# EAGLE design alimentadorV3 (EAGLE 6.6.0)
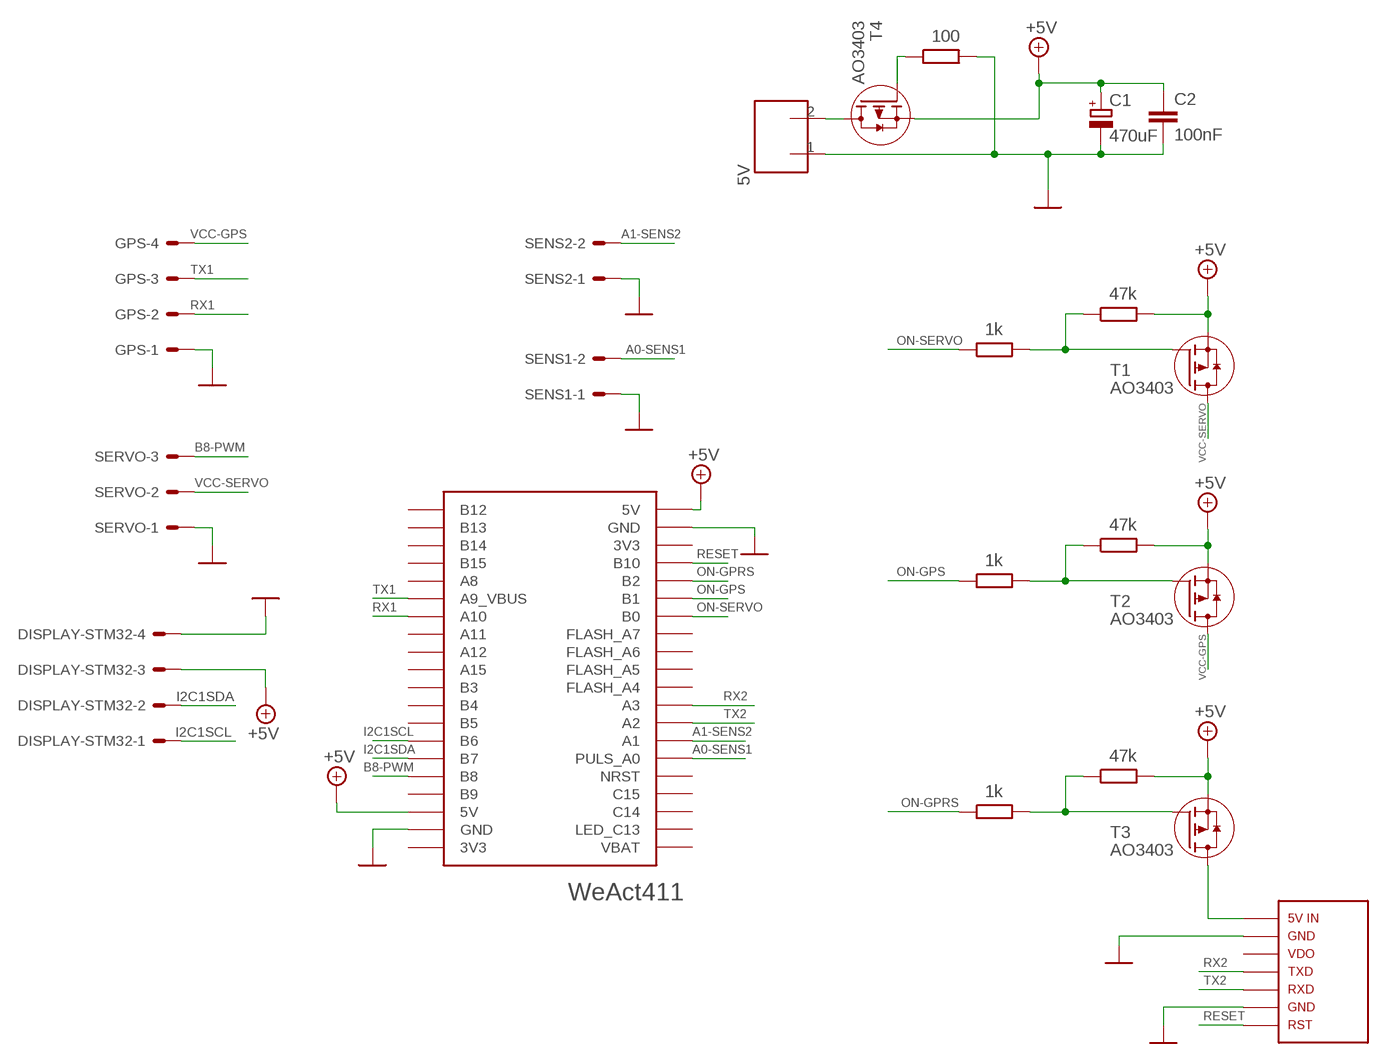
[diagram p0: schematic, sheet 1]

## Parts
5V  CONECTOR_2P-3.81  [CON2P-3.81]
C1  470uF  CPOL-EUE5-10.5  [E5-10,5]
C2  100nF  C-EUC1206  [C1206]
DISPLAY-STM32  22-05-7048-04  [7395-04]
GPS  22-27-2041-04  [6410-04]
R1  47k  R-EU_R1206  [R1206]
R2  47k  R-EU_R1206  [R1206]
R3  1k  R-EU_R1206  [R1206]
R4  1k  R-EU_R1206  [R1206]
R5  47k  R-EU_R1206  [R1206]
R6  1k  R-EU_R1206  [R1206]
R7  100  R-EU_R1206  [R1206]
SENS1  22-27-2021-02  [6410-02]
SENS2  22-27-2021-02  [6410-02]
SERVO  22-27-2031-03  [6410-03]
T1  AO3403  [SOT23]
T2  AO3403  [SOT23]
T3  AO3403  [SOT23]
T4  AO3403  [SOT23]
U$1  SIM800L  [SIM800L]
U$2  WEACT411  [WEACT411]

## Nets
5VIN: T3.3(D) U$1.5VIN
+5V: C1.+ C2.1 DISPLAY-STM32.3 R1.2 R2.2 R5.2 T1.2(S) T2.2(S) T3.2(S) T4.2(S) U$2.5V@1(5V) U$2.5V@2(5V)
A0-SENS1: SENS1.2 U$2.A0(PULS_A0)
A1-SENS2: SENS2.2 U$2.A1
B8-PWM: SERVO.3 U$2.B8
GND [pwr]: 5V.1 C1.- C2.2 DISPLAY-STM32.4 GPS.1 R7.2 SENS1.1 SENS2.1 SERVO.1 U$1.GND@0(GND) U$1.GND@1(GND) U$2.GND@1(GND) U$2.GND@2(GND)
I2C1SCL: DISPLAY-STM32.1 U$2.B6
I2C1SDA: DISPLAY-STM32.2 U$2.B7
N$1: 5V.2 T4.3(D)
N$2: R2.1 R3.2 T1.1(G)
N$3: R7.1 T4.1(G)
N$5: R1.1 R4.2 T2.1(G)
N$8: R5.1 R6.2 T3.1(G)
ON-GPRS: R6.1 U$2.B2
ON-GPS: R4.1 U$2.B1
ON-SERVO: R3.1 U$2.B0
RESET: U$1.RST U$2.B10
RX1: GPS.2 U$2.A10
RX2: U$1.TXD U$2.A3
TX1: GPS.3 U$2.A9(A9_VBUS)
TX2: U$1.RXD U$2.A2
VCC-GPS: GPS.4 T2.3(D)
VCC-SERVO: SERVO.2 T1.3(D)
Unconnected: U$1.VDO U$2.3V3@1(3V3) U$2.3V3@2(3V3) U$2.A4(FLASH_A4) U$2.A5(FLASH_A5) U$2.A6(FLASH_A6) U$2.A7(FLASH_A7) U$2.A8 U$2.A11 U$2.A12 U$2.A15 U$2.B3 U$2.B4 U$2.B5 U$2.B9 U$2.B12 U$2.B13 U$2.B14 U$2.B15 U$2.C13(LED_C13) U$2.C14 U$2.C15 U$2.NRST U$2.VBAT

## Library data of the parts
5V = jcf:CONECTOR_2P-3.81
C1 = rcl:CPOL-EU: POLARIZED CAPACITOR, European symbol
C2 = rcl:C-EU: CAPACITOR, European symbol
DISPLAY-STM32 GPS = con-molex:22-?-04: CONNECTOR wire to board 2.54 mm (.1 inch) pitch header; OC_FARNELL: unknown; OC_NEWARK: unknown
R1-R7 = rcl:R-EU_: RESISTOR, European symbol
SENS1 SENS2 = con-molex:22-?-02: CONNECTOR wire to board 2.54 mm (.1 inch) pitch header; OC_FARNELL: unknown; OC_NEWARK: unknown
SERVO = con-molex:22-?-03: CONNECTOR wire to board 2.54 mm (.1 inch) pitch header; OC_FARNELL: unknown; OC_NEWARK: unknown
T1-T4 = jcf:AO3403: AO3403 P-channel MOSFET 2.6A 30V
U$1 = jcf:SIM800L: SIM800L https://www.amazon.es/dp/B01FK3OPQ6/ref=pe_386191_37038281_TE_3p_dp_1
U$2 = jcf:WEACT411: WeAct STM32F411

## Net classes
0 default: width 0.241 mm, drill 0.584 mm, clearance 0.241 mm
1 pwr: width 0.25 mm

## Board
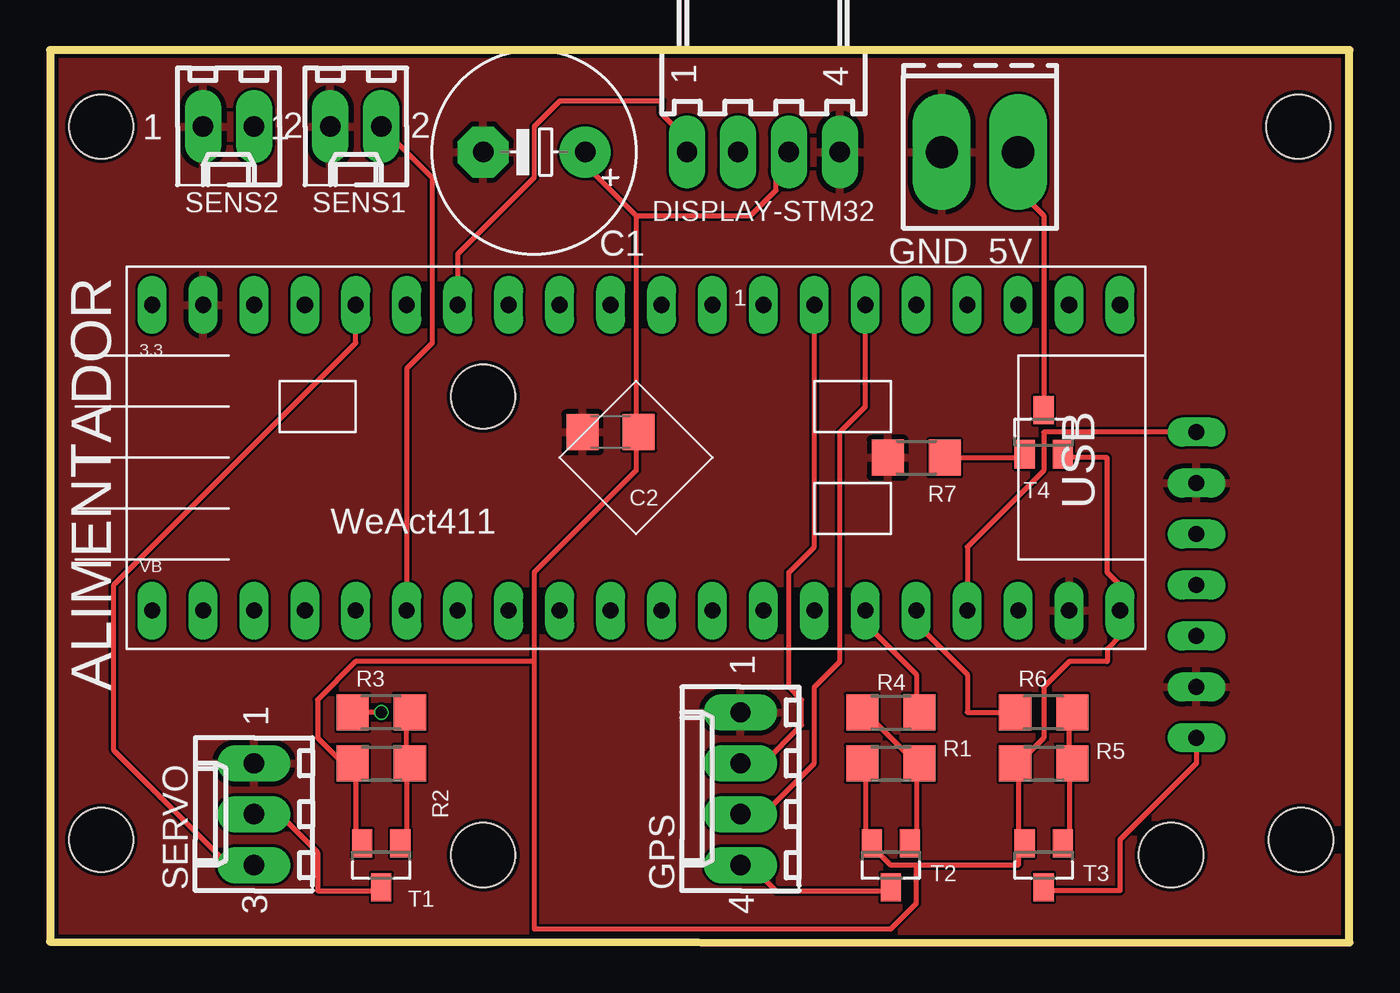
[diagram p1: board, top side]
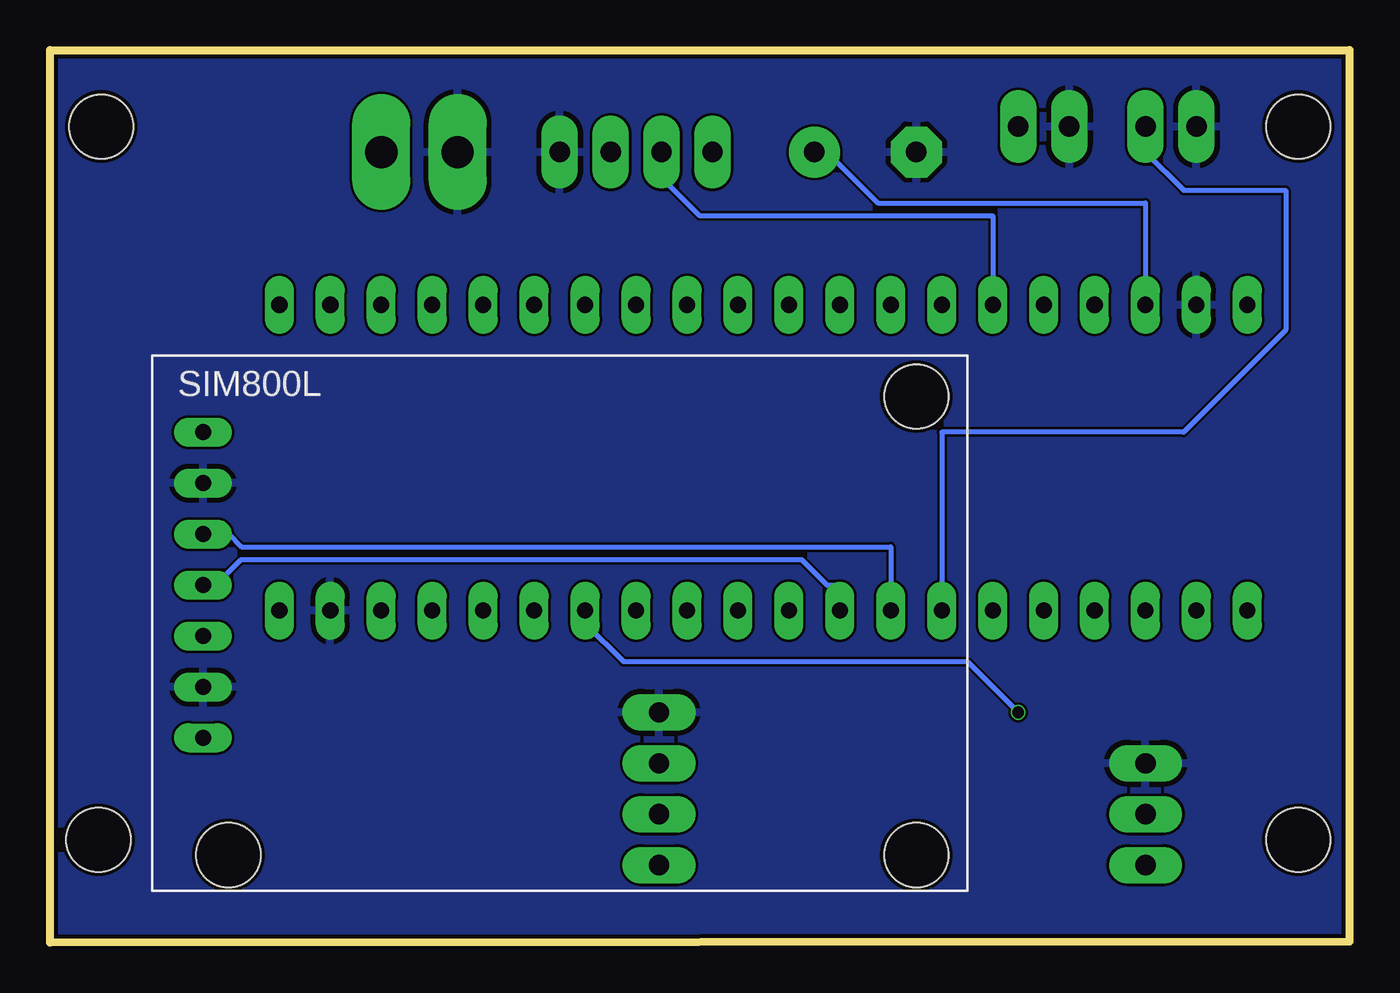
[diagram p2: board, bottom side, seen from below]

Size 64.77 x 44.5 mm. Coordinates in mm from the lower left corner, seen from the top.
Outline: 0,44.5 0,0.05 64.77,0 64.77,44.5 0,44.5
Copper layers (1*16): Top 0.035mm / dielectric 1.6mm / Bottom 0.035mm
Design rules "jlcpcb-2layers": minimum track width 5mil, minimum drill 0.3mm, track to track 5mil, track to pad 5mil, pad to pad 5mil, via to via 5mil, smd to smd 5mil, copper to edge 0.2mm, drill to drill 6mil, minimum pad ring 10mil, minimum via ring 3mil, stop-mask expansion 4mil, vias tented up to drill 0mil, thermal gap 10mil
Holes 3.2 mm at 62.36,5.13 2.54,5.13 62.23,40.69 2.54,40.69

### Footprints (pad centres in the part's own frame; a part is rotated, then mirrored left to right if it is on the bottom)
CON2P-3.81 = drill 1.6 long: 1 0,0; 2 3.81,0
E5-10,5 = drill 1.016 pad 2.54: + -2.54,0 | drill 1.016 pad 2.54 octagon: - 2.54,0
C1206 = smd 1.6 x 1.8: 1 -1.4,0; 2 1.4,0
7395-04 = drill 1.016 long: 1 3.81,0; 2 1.27,0; 3 -1.27,0; 4 -3.81,0
6410-04 = drill 1.016 long: 1 3.81,0; 2 1.27,0; 3 -1.27,0; 4 -3.81,0
R1206 = smd 1.6 x 1.803: 1 -1.422,0; 2 1.422,0
6410-02 = drill 1.016 long: 1 1.27,0; 2 -1.27,0
6410-03 = drill 1.016 long: 1 2.54,0; 2 0,0; 3 -2.54,0
SOT23 = smd 1 x 1.4: 1 -0.95,-1.1; 2 0.95,-1.1; 3 0,1.1
SIM800L = drill 0.8 long: 5VIN -2.54,19.05; GND@0 -2.54,6.35; GND@1 -2.54,16.51; RST -2.54,3.81; RXD -2.54,8.89; TXD -2.54,11.43; VDO -2.54,13.97 | hole 3.2: -3.81,24.892; -38.1,24.892; -38.1,2.032
WEACT411 = drill 0.8 long: 3V3@1 43.18,0; 3V3@2 0,15.24; 5V@1 48.26,0; 5V@2 5.08,15.24; A0 12.7,0; A1 15.24,0; A2 17.78,0; A3 20.32,0; A4 22.86,0; A5 25.4,0; A6 27.94,0; A7 30.48,0; A8 38.1,15.24; A9 35.56,15.24; A10 33.02,15.24; A11 30.48,15.24; A12 27.94,15.24; A15 25.4,15.24; B0 33.02,0; B1 35.56,0; B2 38.1,0; B3 22.86,15.24; B4 20.32,15.24; B5 17.78,15.24; B6 15.24,15.24; B7 12.7,15.24; B8 10.16,15.24; B9 7.62,15.24; B10 40.64,0; B12 48.26,15.24; B13 45.72,15.24; B14 43.18,15.24; B15 40.64,15.24; C13 2.54,0; C14 5.08,0; C15 7.62,0; GND@1 45.72,0; GND@2 2.54,15.24; NRST 10.16,0; VBAT 0,0

### Placement (x,y rotation side)
5V  44.45,39.42 0 top
C1  24.13,39.42 180 top
C2  27.94,25.45 180 top
DISPLAY-STM32  35.56,39.42 180 top
GPS  34.42,7.67 90 top
R1  41.91,8.94 180 top
R2  16.51,8.94 180 top
R3  16.51,11.48 0 top
R4  41.91,11.48 180 top
R5  49.53,8.94 180 top
R6  49.53,11.48 0 top
R7  43.18,24.18 180 top
SENS1  15.24,40.69 180 top
SENS2  8.89,40.69 180 top
SERVO  10.16,6.4 90 top
T1  16.51,3.86 180 top
T2  41.91,3.86 180 top
T3  49.53,3.86 180 top
T4  49.53,25.45 0 top
U$1  59.69,29.26 180 bottom
U$2  5.08,16.56 0 top

### Tracks (layer width: path | path; a pad name or v marks a point on that pad's centre or on a via)
5VIN
  Top 0.241: U$1.5VIN 57.15,8.94 53.34,5.13 53.34,2.59 49.53,2.59 T3.3
+5V
  Top 0.241: R1.2 40.64,8.94 40.64,5.13 T2.2 41.27,4.5 41.91,3.86 43.18,3.86 | 48.26,8.94 48.26,5.13 T3.2 48.26,4.5 48.26,3.86 43.18,3.86 | T4.2 50.8,24.18 52.7,24.18 52.7,18.47 53.34,17.83 U$2.5V@1 53.34,15.29 52.7,14.66 52.7,14.02 50.8,14.02 49.53,12.75 49.53,10.21 48.26,8.94 | 48.26,8.94 R5.2 | T1.2 15.24,5.13 15.24,8.94 R2.2 14.61,8.94 13.34,10.21 13.34,12.12 15.24,14.02 24.13,14.02 | 29.21,36.25 29.21,25.45 | 29.21,36.25 26.67,38.79 C1.+ | 24.13,14.02 24.13,18.47 29.21,23.55 29.21,25.45 | 29.21,25.45 C2.1 | DISPLAY-STM32.3 36.2,38.79 36.2,37.52 34.92,36.25 29.21,36.25 | 43.18,3.86 43.18,1.96 41.91,0.69 24.13,0.69 24.13,14.02
  Bottom 0.241: U$2.5V@2 10.16,36.88 23.49,36.88 26.04,39.42 C1.+
A0-SENS1
  Top 0.241: U$2.A0 17.78,28.63 19.05,29.9 19.05,38.15 SENS1.2
A1-SENS2
  Bottom 0.241: U$2.A1 20.32,25.45 8.25,25.45 3.17,30.53 3.17,37.52 8.25,37.52 10.16,39.42 SENS2.2
B8-PWM
  Top 0.241: U$2.B8 15.24,29.9 3.17,17.83 3.17,9.58 8.89,3.86 SERVO.3
GND
  pour Bottom: 0,0.05 64.77,0.03 64.77,44.5 0,44.5
  pour Top: 0,44.5 64.77,44.5 64.77,0.03 0,0.05
I2C1SCL
  Top 0.241: U$2.B6 20.32,34.34 24.13,38.15 24.13,40.69 25.4,41.96 30.48,41.96 30.48,41.33 31.75,40.06 DISPLAY-STM32.1
I2C1SDA
  Bottom 0.241: U$2.B7 17.78,36.25 32.38,36.25 34.29,38.15 DISPLAY-STM32.2
N$1
  Top 0.241: T4.3 49.53,36.25 48.26,37.52 5V.2
N$2
  Top 0.241: 17.78,8.94 17.78,5.13 T1.1 | 17.78,8.94 17.78,11.48 R3.2 | 17.78,8.94 R2.1
N$3
  Top 0.241: R7.1 48.26,24.18 T4.1
N$5
  Top 0.241: 43.18,8.94 43.18,5.13 T2.1 | 43.18,8.94 40.64,11.48 R4.2 | 43.18,8.94 R1.1
N$8
  Top 0.241: 50.8,8.94 50.8,5.13 T3.1 | 50.8,8.94 50.8,11.48 R6.2 | 50.8,8.94 R5.1
ON-GPRS
  Top 0.241: R6.1 45.72,11.48 45.72,13.39 43.18,15.93 U$2.B2
ON-GPS
  Top 0.241: U$2.B1 40.64,15.93 43.18,13.39 43.18,11.48 R4.1
ON-SERVO  (via drill 0.58)
  Top 0.241: v16.51,11.48 R3.1
  Bottom 0.241: v16.51,11.48 19.05,14.02 36.2,14.02 38.1,15.93 U$2.B0
RESET
  Top 0.241: U$2.B10 45.72,19.74 49.53,23.55 49.53,25.45 U$1.RST
RX1
  Top 0.241: U$2.A10 38.1,19.74 36.83,18.47 36.83,12.75 37.46,12.12 37.46,10.85 35.56,8.94 GPS.2
RX2
  Bottom 0.241: U$2.A3 25.4,17.83 26.04,17.83 27.3,19.1 55.24,19.1 56.52,17.83 U$1.TXD
TX1
  Top 0.241: U$2.A9 40.64,26.72 39.37,25.45 39.37,14.02 38.1,12.75 38.1,8.94 35.56,6.4 GPS.3
TX2
  Bottom 0.241: U$2.A2 22.86,19.74 55.24,19.74 55.88,20.37 U$1.RXD
VCC-GPS
  Top 0.241: T2.3 41.91,2.59 36.2,2.59 34.92,3.86 GPS.4
VCC-SERVO
  Top 0.241: SERVO.2 11.43,6.4 13.34,4.5 13.34,2.59 16.51,2.59 T1.3

### Text on the board
tPlace: GND 5V
tNames: 1 | ALIMENTADOR